# Altium schematic sheet KS_V3S.SchDoc
size A1
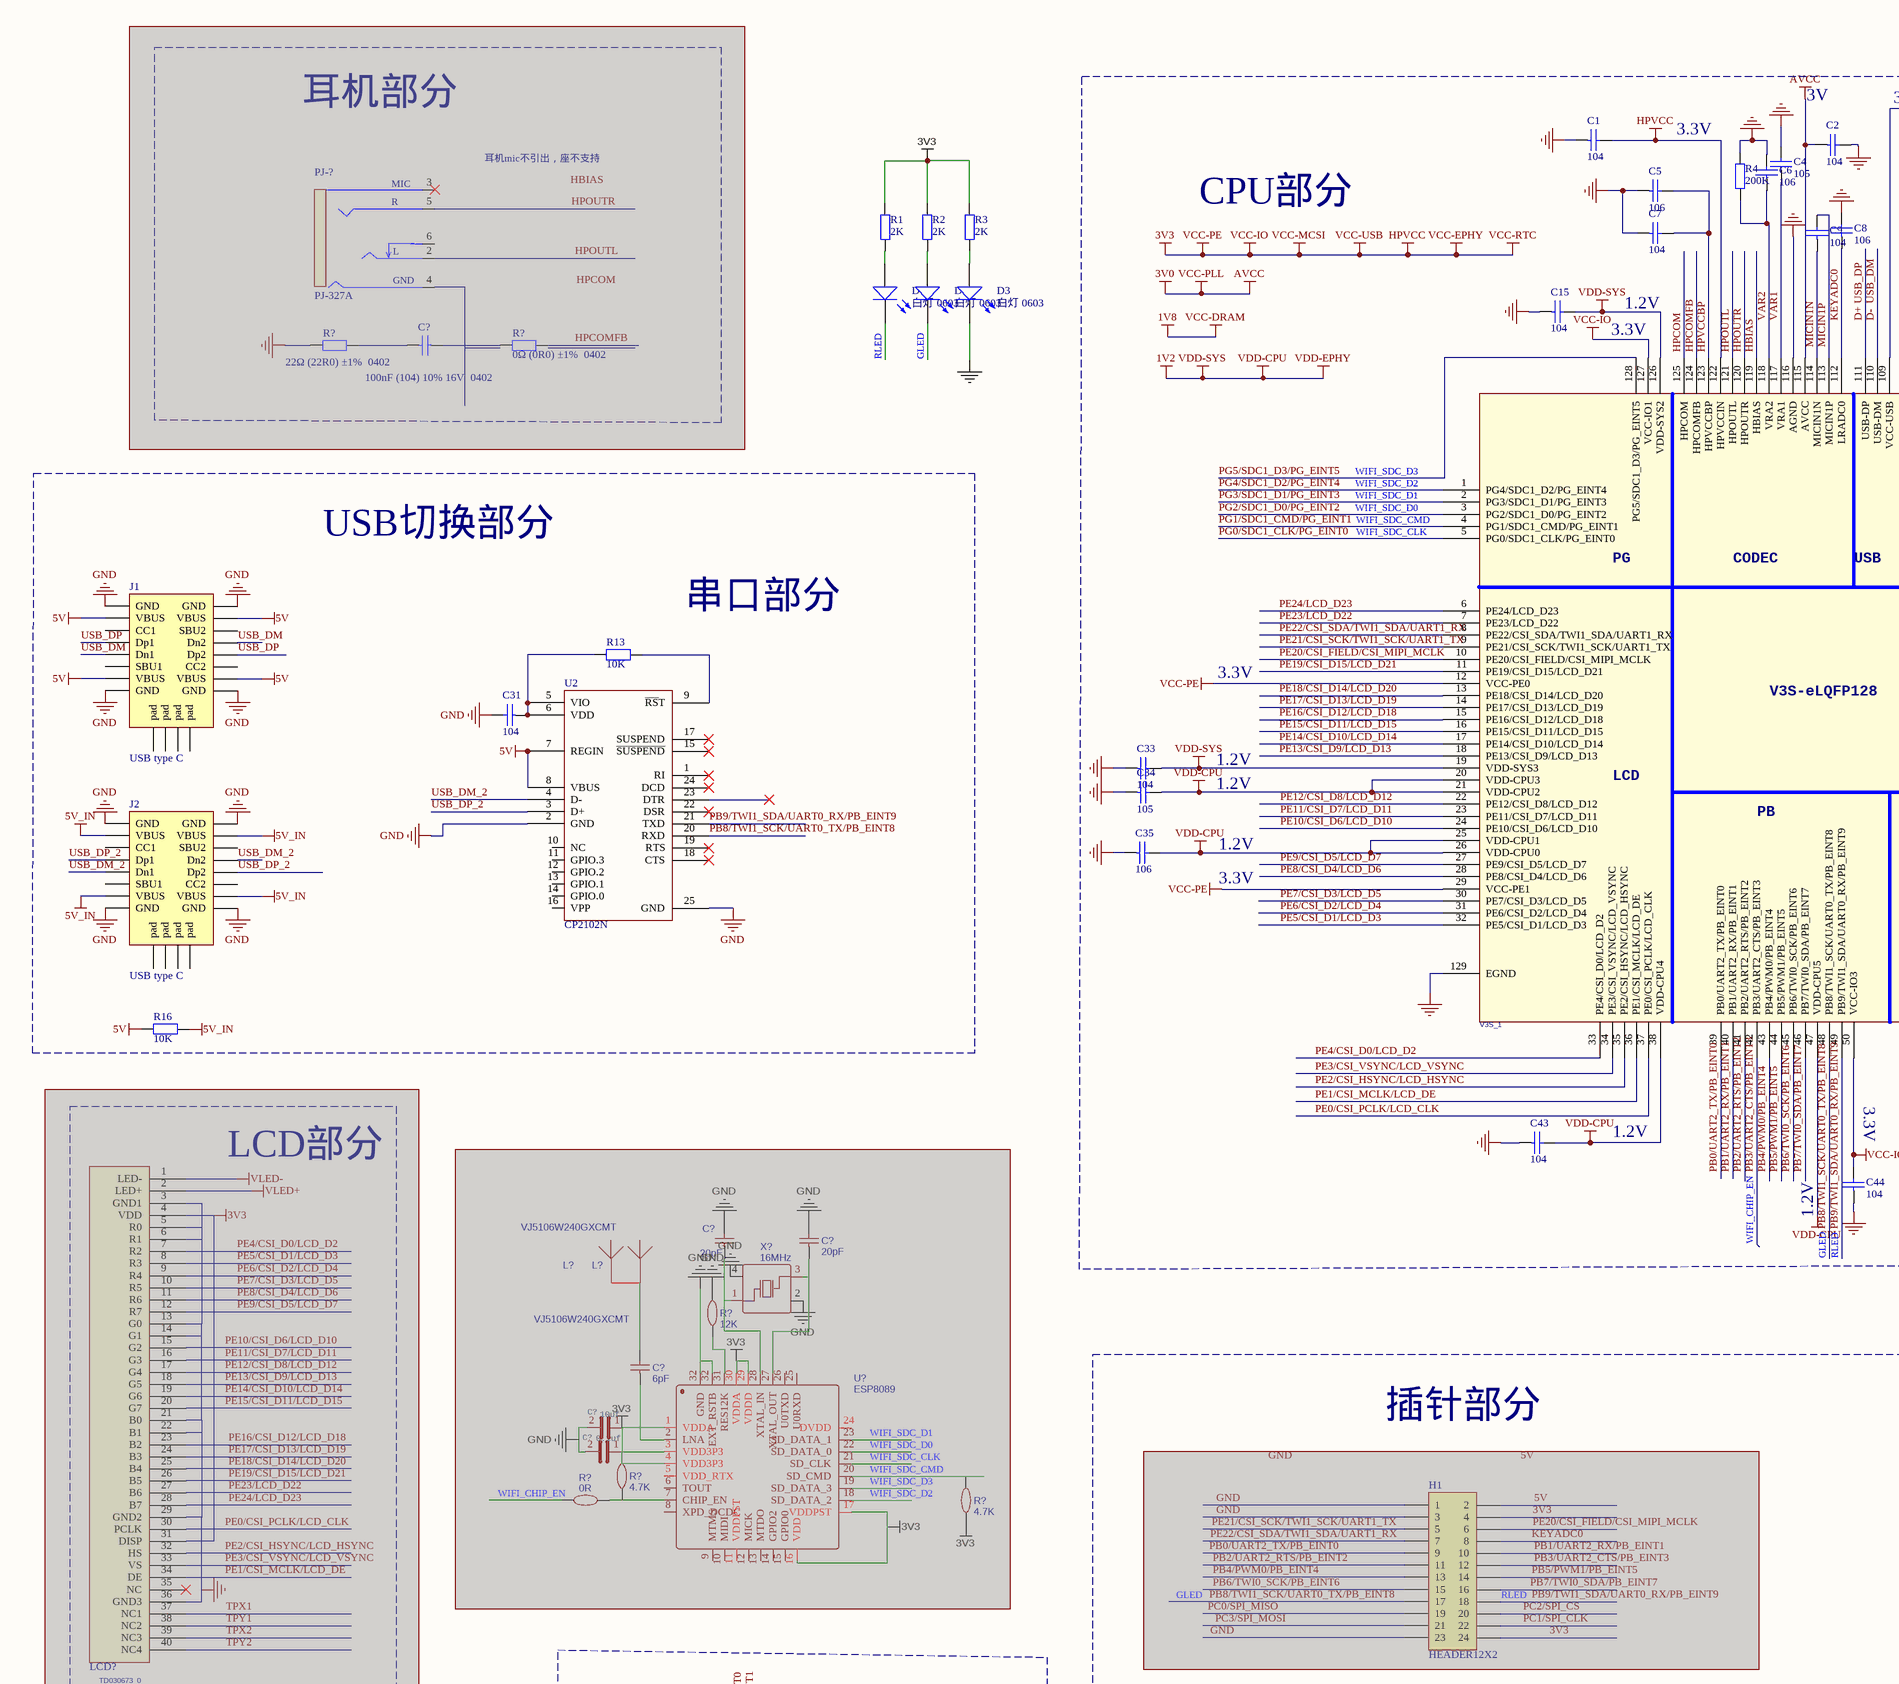
[diagram p0: KS_V3S.SchDoc, top left]
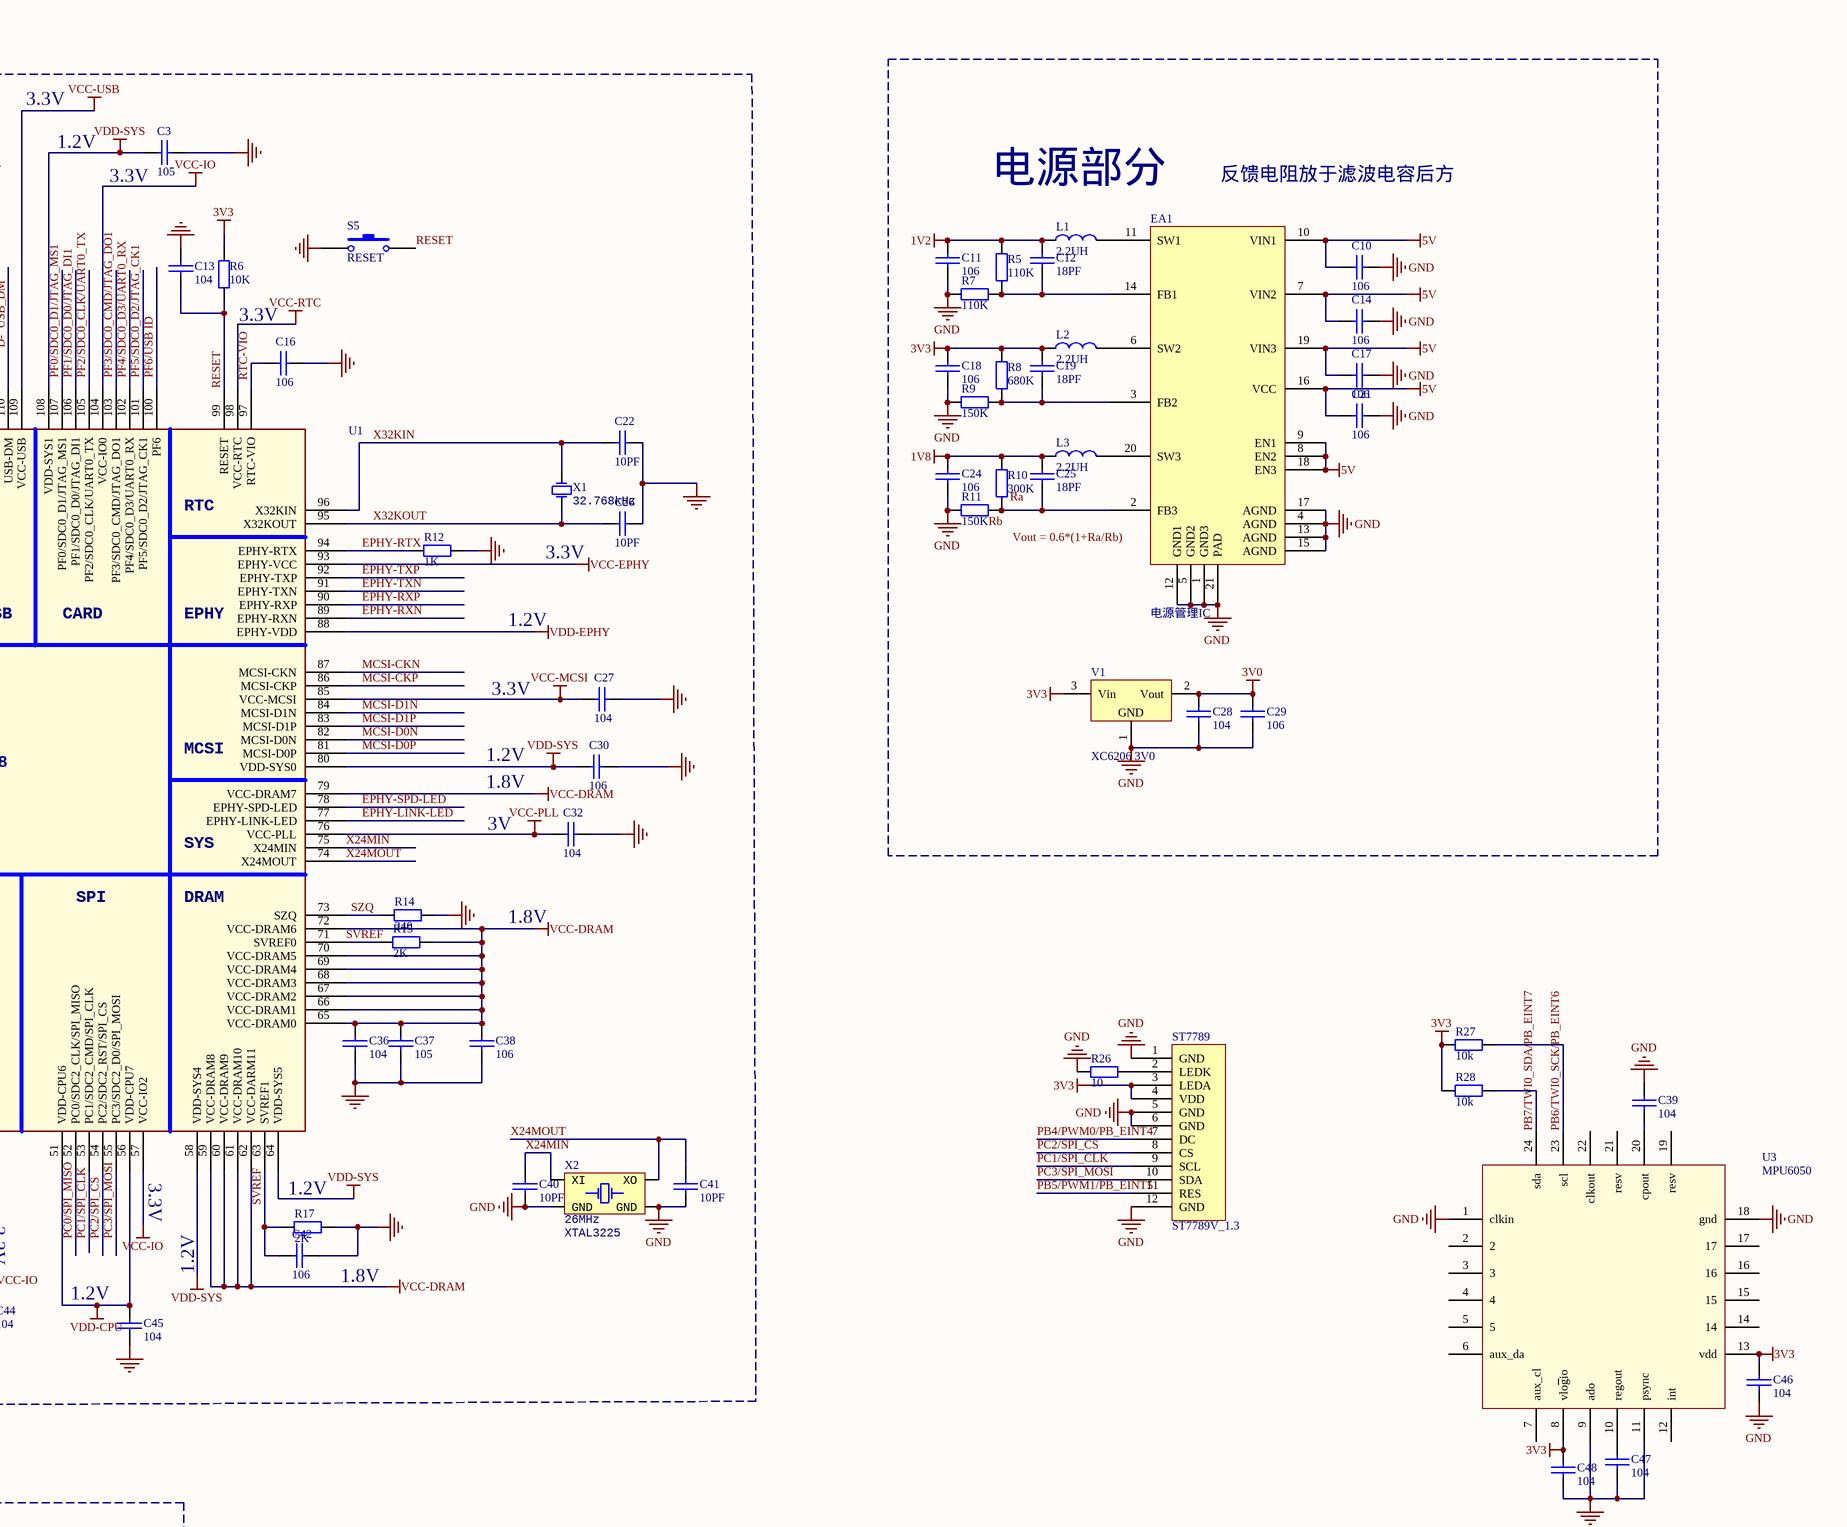
[diagram p1: KS_V3S.SchDoc, top right]
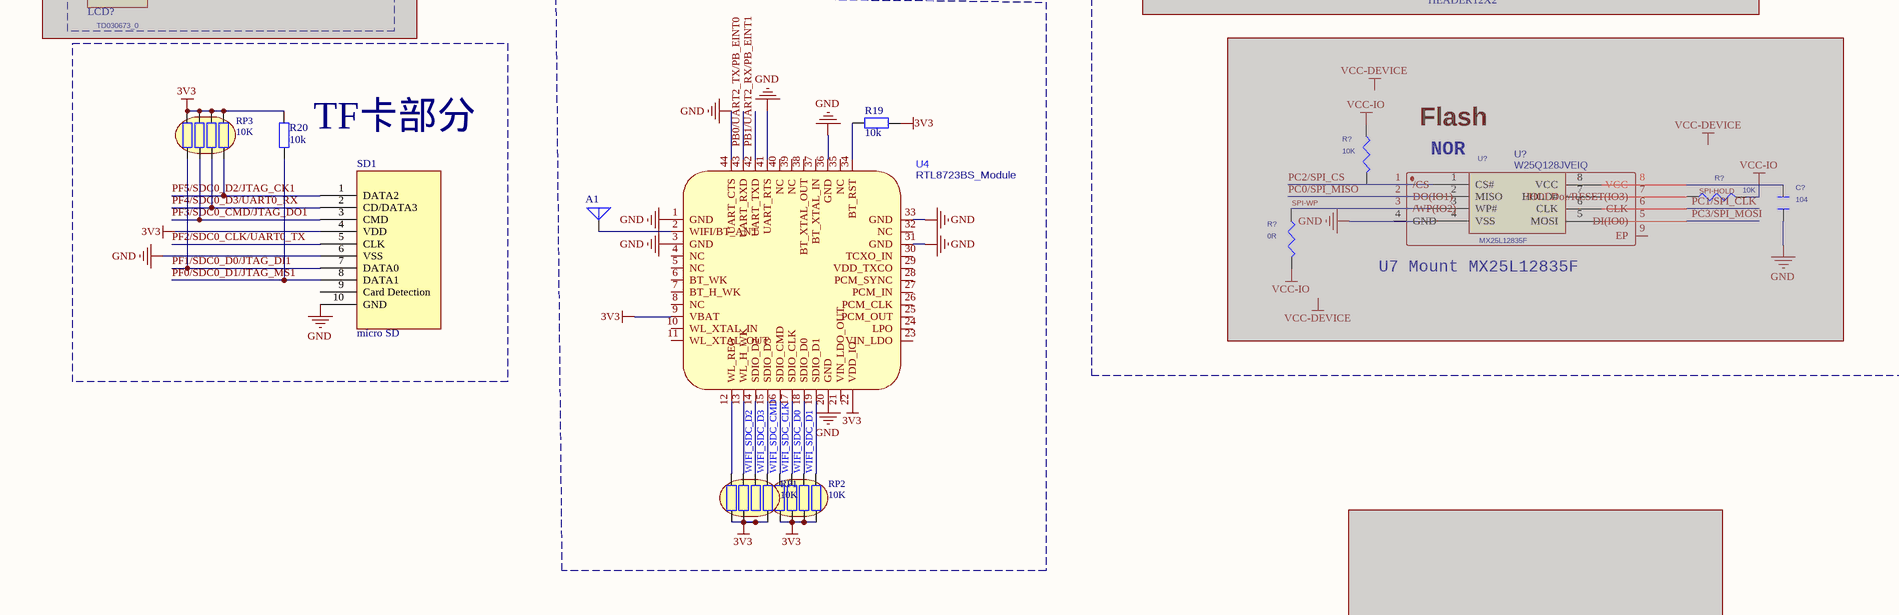
[diagram p2: KS_V3S.SchDoc, bottom left]
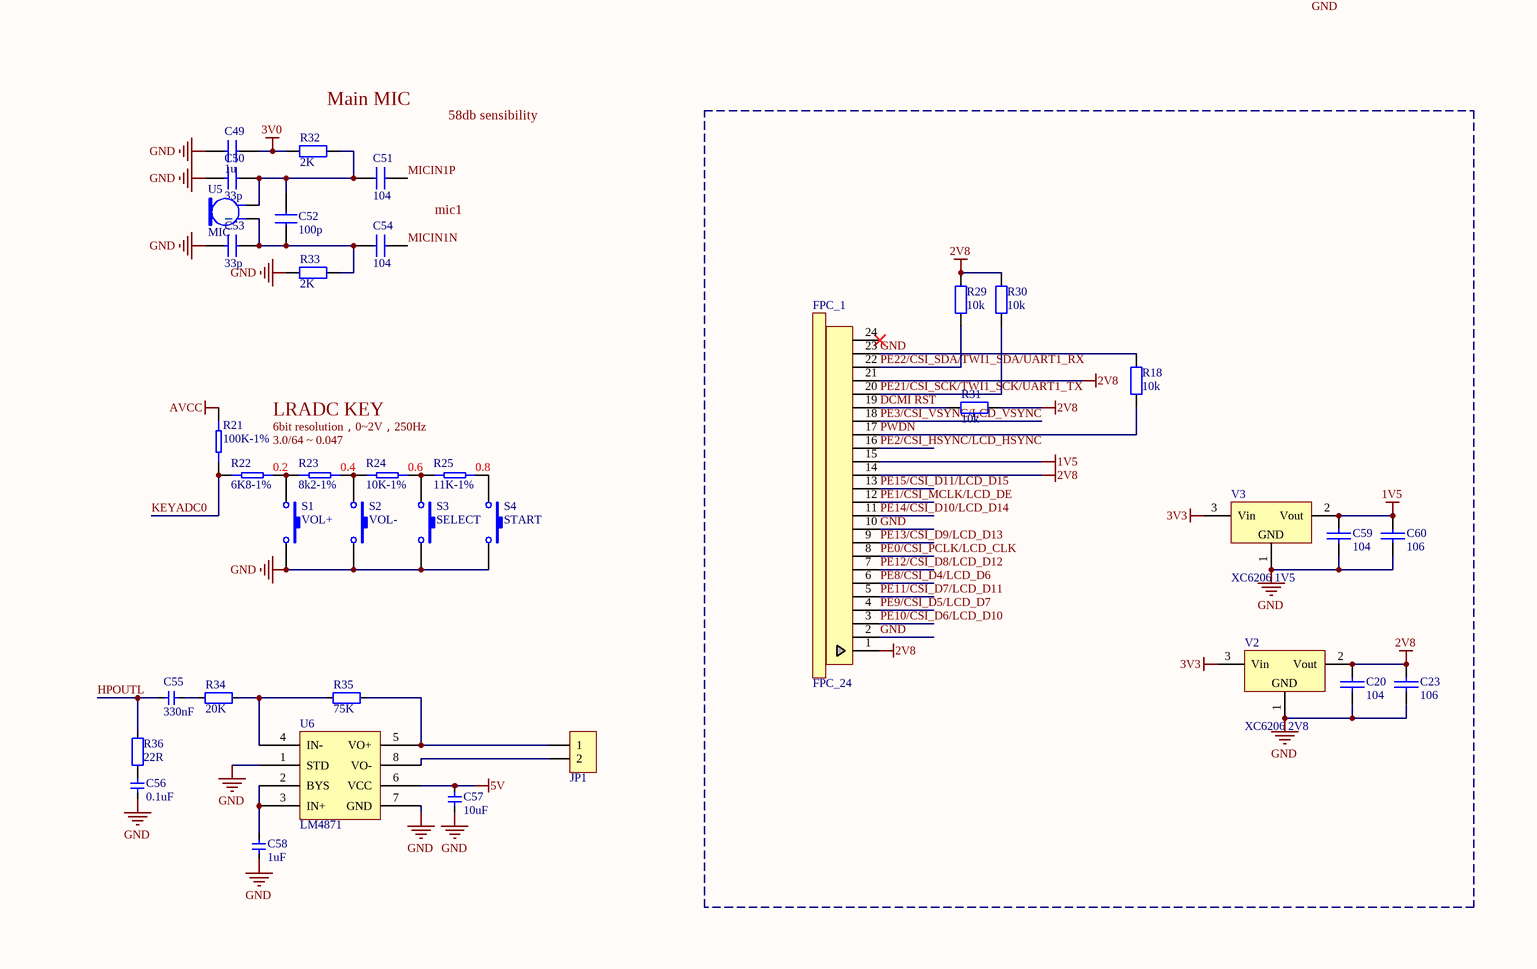
[diagram p3: KS_V3S.SchDoc, bottom right]

## Parts
(Parts that share a designator on the sheet are numbered #1, #2 ... from top to bottom, then left to right.)
A1  IPX_SMA  [IPX_SMA]  (value not drawn)
C1  104  [CAP_0402]
C2  104  [CAP_0402]
C3  105  [CAP_0402]
C4  105  [CAP_0402]
C5  106  [0603_C]
C6  106  [CAP_0402]
C7  104  [CAP_0402]
C8  106  [CAP_0402]
C9  104  [CAP_0402]
C10  106  [0805_C]
C11  106  [CAP_0402]
C12  18PF  [CAP_0402]
C13  104  [CAP_0402]
C14  106  [CAP_0402]
C15  104  [CAP_0402]
C16  106  [0805_C]
C17  106  [CAP_0402]
C18  106  [CAP_0402]
C19  18PF  [CAP_0402]
C20  104  [CAP_0402]
C21  106  [CAP_0402]
C22  10PF  [CAP_0402]
C23  106  [CAP_0402]
C24  106  [CAP_0402]
C25  18PF  [CAP_0402]
C26  10PF  [CAP_0402]
C27  104  [CAP_0402]
C28  104  [CAP_0402]
C29  106  [CAP_0402]
C30  106  [0603_C]
C31  104  [CAP_0402]
C32  104  [CAP_0402]
C33  104  [CAP_0402]
C34  105  [CAP_0402]
C35  106  [0603_C]
C36  104  [CAP_0402]
C37  105  [CAP_0402]
C38  106  [0603_C]
C39  104  [CAP_0402]
C40  10PF  [CAP_0402]
C41  10PF  [CAP_0402]
C42  106  [0603_C]
C43  104  [CAP_0402]
C44  104  [CAP_0402]
C45  104  [CAP_0402]
C46  104  [CAP_0402]
C47  104  [CAP_0402]
C48  104  [CAP_0402]
C49  1u  [CAP_0402]
C50  33p  [CAP_0402]
C51  104  [CAP_0402]
C52  100p  [CAP_0402]
C53  33p  [CAP_0402]
C54  104  [CAP_0402]
C55  330nF  [CAP_0402]
C56  0.1uF  [CAP_0402]
C57  10uF  [0805_C]
C58  1uF  [CAP_0402]
C59  104  [CAP_0402]
C60  106  [CAP_0402]
C?#1  100nF (104) 10% 16V  0402  [0402_R]  (masked out: inside a compile mask, not in the netlist)
C?#2  20pF  [0402]  (masked out: inside a compile mask, not in the netlist)
C?#3  20pF  [0402]  (masked out: inside a compile mask, not in the netlist)
C?#4  6pF  [0402]  (masked out: inside a compile mask, not in the netlist)
C?#5  10uf  [0603C]  (masked out: inside a compile mask, not in the netlist)
C?#6  0.1uf  [0402]  (masked out: inside a compile mask, not in the netlist)
C?#7  104  [C0402]  (masked out: inside a compile mask, not in the netlist)
D1  白灯 0603  [0603_LED_S1]
D2  白灯 0603  [0603_LED_S1]
D3  白灯 0603  [0603_LED_S1]
EA1  电源管理IC  [QFN20 3x3_M]
FPC_1  FPC_24  [FPC_24]
H1  HEADER12X2  [HEADER12X2]  (masked out: inside a compile mask, not in the netlist)
J1  USB type C  [USB Type-C-16Pin_A]
J2  USB type C  [USB Type-C-16Pin_A]
JP1  HDR-1X2  [MX 1.25-WI-2P]  (value not drawn)
L1  2.2UH  [2520-L]
L2  2.2UH  [2520-L]
L3  2.2UH  [2520-L]
L?#1  VJ5106W240GXCMT  [ANT-SMD_L3.1-W1.6]  (masked out: inside a compile mask, not in the netlist)
L?#2  VJ5106W240GXCMT  [ANT-SMD_2P-L11.4-W3.5]  (masked out: inside a compile mask, not in the netlist)
LCD?  TD030673_0  [FPC40pin]  (masked out: inside a compile mask, not in the netlist)
PJ-?  PJ-327A  [PJ-327A]  (masked out: inside a compile mask, not in the netlist)
R1  value 2K  [RES_0402]  (hidden comment: Res2)
R2  value 2K  [RES_0402]  (hidden comment: Res2)
R3  value 2K  [RES_0402]  (hidden comment: Res2)
R4  value 200K  [RES_0402]  (hidden comment: Res2)
R5  value 110K  [RES_0402]  (hidden comment: Res2)
R6  value 10K  [RES_0402]  (hidden comment: Res2)
R7  value 110K  [RES_0402]  (hidden comment: Res2)
R8  value 680K  [RES_0402]  (hidden comment: Res2)
R9  value 150K  [RES_0402]  (hidden comment: Res2)
R10  value 300K  [RES_0402]  (hidden comment: Res2)
R11  value 150K  [RES_0402]  (hidden comment: Res2)
R12  value 1K  [RES_0402]  (hidden comment: Res2)
R13  10K  [RES_0402]
R14  value 240  [RES_0402]  (hidden comment: Res2)
R15  value 2K  [RES_0402]  (hidden comment: Res2)
R16  value 10K  [LC-0805_R]  (hidden comment: 1A保险丝)
R17  value 2K  [RES_0402]  (hidden comment: Res2)
R18  value 10k  [RES_0402]  (hidden comment: Res2)
R19  value 10k  [RES_0402]  (hidden comment: Res2)
R20  value 10k  [RES_0402]  (hidden comment: Res2)
R21  100K-1%  [RES_0402]
R22  6K8-1%  [RES_0402]
R23  8k2-1%  [RES_0402]
R24  10K-1%  [RES_0402]
R25  11K-1%  [RES_0402]
R26  value 10  [RES_0402]  (hidden comment: Res2)
R27  value 10k  [RES_0402]  (hidden comment: Res2)
R28  value 10k  [RES_0402]  (hidden comment: Res2)
R29  value 10k  [RES_0402]  (hidden comment: Res2)
R30  value 10k  [RES_0402]  (hidden comment: Res2)
R31  value 10k  [RES_0402]  (hidden comment: Res2)
R32  value 2K  [RES_0402]  (hidden comment: Res2)
R33  value 2K  [RES_0402]  (hidden comment: Res2)
R34  20K  [RES_0402]
R35  75K  [RES_0402]
R36  22R  [RES_0402]
R?#1  22Ω (22R0) ±1%  0402  [0402_R]  (masked out: inside a compile mask, not in the netlist)
R?#2  0Ω (0R0) ±1%  0402  [0402_R]  (masked out: inside a compile mask, not in the netlist)
R?#3  12K  [0402]  (masked out: inside a compile mask, not in the netlist)
R?#4  4.7K  [0402]  (masked out: inside a compile mask, not in the netlist)
R?#5  0R  [0402]  (masked out: inside a compile mask, not in the netlist)
R?#6  4.7K  [0402]  (masked out: inside a compile mask, not in the netlist)
R?#7  10K  [0402]  (masked out: inside a compile mask, not in the netlist)
R?#8  10K  [0402]  (masked out: inside a compile mask, not in the netlist)
R?#9  0R  [0402]  (masked out: inside a compile mask, not in the netlist)
RP1  10K  [RCA-8P4R-0603]
RP2  10K  [RCA-8P4R-0603]
RP3  10K  [RCA-8P4R-0603]
S1  VOL+  [KEY_1]
S2  VOL-  [KEY_1]
S3  SELECT  [KEY_1]
S4  START  [KEY_1]
S5  RESET  [KEY_1]
SD1  micro SD  [TF卡座 短体 molex47309-2851_MOL]
ST7789  ST7789V_1.3  [ST7789V_12Pin]
U1  V3S_1  [LQFP129 14x14_N]
U2  CP2102N  [QFN24 4x4_N]
U3  MPU6050  [QFN24 4x4_M]
U4  RTL8723BS_Module  [R8723BS]
U5  MIC  [MIC-0416]
U6  LM4871  [MSOP-8]
U?#1  ESP8089  [QFN-32_L5.0-W5.0-P0.50-BL-EP3.7]  (masked out: inside a compile mask, not in the netlist)
U?#2  MX25L12835F  [SOIC-8_L5.3-W5.3-P1.27-LS8.0-BL]  (masked out: inside a compile mask, not in the netlist)
U?#3  W25Q128JVEIQ  [WSON-8_L6.0-W8.0-P1.27-BL-EP]  (masked out: inside a compile mask, not in the netlist)
V1  XC6206 3V0  [SOT23-3N]
V2  XC6206 2V8  [SOT23-3N]
V3  XC6206 1V5  [SOT23-3N]
X1  32.768kHz  [XT_3215_2]
X2  Type: XTAL3225  [XT_3225_4]  (hidden comment: 26MHz)
X?  16MHz  [OSC-SMD_4P-L3.2-W2.5-BL_SIT1602AI]  (masked out: inside a compile mask, not in the netlist)

## Blocks framed on the sheet
耳机部分: C?#1 PJ-? R?#1 R?#2
CPU部分: C1-C9 C13 C15 C16 C22 C26 C27 C30 C32-C38 C40-C45 R4 R6 R12 R14 R15 R17 S5 U1 X1 X2
电源部分: C10-C12 C14 C17-C19 C21 C24 C25 C28 C29 EA1 L1-L3 R5 R7-R11 V1
LCD部分: LCD?
插针部分: C?#7 H1 R?#7-R?#9 U?#2 U?#3
TF卡部分: R20 RP3 SD1

## Nets
1V2: C3.1 C11.2 C12.1 C15.2 C30.1 C33.2 C34.2 C35.2 C43.2 C45.2 L1.2 R5.2 U1.19(VDD-SYS3) U1.20(VDD-CPU3) U1.21(VDD-CPU2) U1.25(VDD-CPU1) U1.26(VDD-CPU0) U1.38(VDD-CPU4) U1.47(VDD-CPU5) U1.51(VDD-CPU6) U1.56(VDD-CPU7) U1.58(VDD-SYS4) U1.64(VDD-SYS5) U1.80(VDD-SYS0) U1.88(EPHY-VDD) U1.108(VDD-SYS1) U1.126(VDD-SYS2)  [also labelled VDD-CPU, VDD-EPHY, VDD-SYS]
1V5: C59.1 C60.1 FPC_1.15 V3.2(Vout)
1V8: C24.2 C25.1 C36.2 C37.2 C38.2 L3.2 R10.2 R15.1 U1.59(VCC-DRAM8) U1.60(VCC-DRAM9) U1.61(VCC-DRAM10) U1.62(VCC-DARM11) U1.65(VCC-DRAM0) U1.66(VCC-DRAM1) U1.67(VCC-DRAM2) U1.68(VCC-DRAM3) U1.69(VCC-DRAM4) U1.70(VCC-DRAM5) U1.72(VCC-DRAM6) U1.79(VCC-DRAM7)  [also labelled VCC-DRAM]
2V8: C20.1 C23.1 FPC_1.1 FPC_1.14 FPC_1.21 R29.2 R30.2 R31.1 V2.2(Vout)
3V0: C2.1 C28.1 C29.1 C32.1 C49.1 R21.1 R32.2 U1.76(VCC-PLL) U1.115(AVCC) V1.2(Vout)  [also labelled AVCC, VCC-PLL]
3V3: C1.2 C18.2 C19.1 C27.1 C44.2 C46.2 C48.2 L2.2 R1.1 R2.1 R3.1 R6.2 R8.2 R19.1 R20.1 R27.2 R28.2 RP1.5 RP1.6 RP1.7 RP1.8 RP2.5 RP2.6 RP2.7 RP2.8 RP3.1 RP3.2 RP3.3 RP3.4 SD1.4(VDD) ST7789.3(LEDA) ST7789.4(VDD) U1.12(VCC-PE0) U1.29(VCC-PE1) U1.50(VCC-IO3) U1.57(VCC-IO2) U1.85(VCC-MCSI) U1.93(EPHY-VCC) U1.98(VCC-RTC) U1.104(VCC-IO0) U1.109(VCC-USB) U1.122(HPVCCIN) U1.127(VCC-IO1) U3.8(vlo~{g}io) U3.13(vdd) U4.9(VBAT) U4.22(VDD_IO) V1.3(Vin) V2.3(Vin) V3.3(Vin)  [also labelled HPVCC, VCC-EPHY, VCC-IO, VCC-MCSI, VCC-PE, VCC-RTC, VCC-USB]
5V: C10.1 C14.1 C17.1 C21.1 C57.2 EA1.7(VIN2) EA1.8(EN2) EA1.9(EN1) EA1.10(VIN1) EA1.16(VCC) EA1.18(EN3) EA1.19(VIN3) J1.A4(VBUS) J1.A9(VBUS) J1.B4(VBUS) J1.B9(VBUS) R16.1 U2.7(REGIN) U2.8(VBUS) U6.6(VCC)
5V_IN: J2.A4(VBUS) J2.A9(VBUS) J2.B4(VBUS) J2.B9(VBUS) R16.2
GND: C1.1 C2.2 C3.2 C4.2 C5.1 C6.2 C7.1 C8.2 C10.2 C11.1 C13.2 C14.2 C15.1 C16.2 C17.2 C18.1 C20.2 C21.2 C22.2 C23.2 C24.1 C26.2 C27.2 C28.2 C29.2 C30.2 C31.2 C32.2 C33.1 C34.1 C35.1 C36.1 C37.1 C38.1 C39.2 C40.2 C41.2 C42.2 C43.1 C44.1 C45.1 C46.1 C47.1 C48.1 C49.2 C50.1 C53.1 C56.1 C57.1 C58.1 C59.2 C60.2 D3.K EA1.1(GND3) EA1.4(AGND) EA1.5(GND2) EA1.12(GND1) EA1.13(AGND) EA1.15(AGND) EA1.17(AGND) EA1.21(PAD) FPC_1.2 FPC_1.10 FPC_1.23 J1.A1(GND) J1.A12(GND) J1.B1(GND) J1.B12(GND) J2.A1(GND) J2.A12(GND) J2.B1(GND) J2.B12(GND) R4.2 R7.1 R9.1 R11.1 R12.1 R14.1 R17.1 R18.2 R26.2 R33.2 S1.1 S2.1 S3.1 S4.1 S5.2 SD1.6(VSS) SD1.10(GND) ST7789.1(GND) ST7789.5(GND) ST7789.6(GND) ST7789.12(GND) U1.116(AGND) U1.129(EGND) U2.2(GND) U2.25(GND) U3.1(clkin) U3.9(ado) U3.11(psync) U3.18(gnd) U4.1(GND) U4.3(GND) U4.20(GND) U4.31(GND) U4.33(GND) U4.36(GND) U4.41(UART_RTS) U4.44(UART_CTS) U6.1(STD) U6.7(GND) V1.1(GND) V2.1(GND) V3.1(GND) X2.2(GND) X2.4(GND)
D+: J1.A6(Dp1) J1.B6(Dp2) U1.111(USB-DP)  [also labelled USB_DP]
D-: J1.A7(Dn1) J1.B7(Dn2) U1.110(USB-DM)  [also labelled USB_DM]
DCMI RST: FPC_1.19 R31.2
EPHY-LINK-LED: U1.77(EPHY-LINK-LED)
EPHY-RTX: R12.2 U1.94(EPHY-RTX)
EPHY-RXN: U1.89(EPHY-RXN)
EPHY-RXP: U1.90(EPHY-RXP)
EPHY-SPD-LED: U1.78(EPHY-SPD-LED)
EPHY-TXN: U1.91(EPHY-TXN)
EPHY-TXP: U1.92(EPHY-TXP)
GLED: D2.K U1.48(PB8/TWI1_SCK/UART0_TX/PB_EINT8) U2.20(RXD)  [also labelled PB8/TWI1_SCK/UART0_TX/PB_EINT8]
HBIAS: U1.119(HBIAS)
HPCOM: U1.125(HPCOM)
HPCOMFB: U1.124(HPCOMFB)
HPOUTL: C55.2 R36.2 U1.121(HPOUTL)
HPOUTR: U1.120(HPOUTR)
HPVCCBP: C5.2 C7.2 U1.123(HPVCCBP)
KEYADC0: C8.1 R21.2 R22.2 U1.112(LRADC0)
MCSI-CKN: U1.87(MCSI-CKN)
MCSI-CKP: U1.86(MCSI-CKP)
MCSI-D0N: U1.82(MCSI-D0N)
MCSI-D0P: U1.81(MCSI-D0P)
MCSI-D1N: U1.84(MCSI-D1N)
MCSI-D1P: U1.83(MCSI-D1P)
MICIN1N: C9.1 C54.2 U1.114(MICIN1N)
MICIN1P: C9.2 C51.2 U1.113(MICIN1P)
PB0/UART2_TX/PB_EINT0: U1.39(PB0/UART2_TX/PB_EINT0) U4.43(UART_RXD)
PB1/UART2_RX/PB_EINT1: U1.40(PB1/UART2_RX/PB_EINT1) U4.42(UART_TXD)
PB2/UART2_RTS/PB_EINT2: U1.41(PB2/UART2_RTS/PB_EINT2)
PB3/UART2_CTS/PB_EINT3: U1.42(PB3/UART2_CTS/PB_EINT3)  [also labelled WIFI_CHIP_EN]
PB4/PWM0/PB_EINT4: ST7789.7(DC) U1.43(PB4/PWM0/PB_EINT4)
PB5/PWM1/PB_EINT5: ST7789.11(RES) U1.44(PB5/PWM1/PB_EINT5)
PB6/TWI0_SCK/PB_EINT6: R27.1 U1.45(PB6/TWI0_SCK/PB_EINT6) U3.23(scl)
PB7/TWI0_SDA/PB_EINT7: R28.1 U1.46(PB7/TWI0_SDA/PB_EINT7) U3.24(sda)
PB9/TWI1_SDA/UART0_RX/PB_EINT9: D1.K U1.49(PB9/TWI1_SDA/UART0_RX/PB_EINT9) U2.21(TXD)  [also labelled RLED]
PC0/SPI_MISO: U1.52(PC0/SDC2_CLK/SPI_MISO)
PC1/SPI_CLK: ST7789.9(SCL) U1.53(PC1/SDC2_CMD/SPI_CLK)
PC2/SPI_CS: ST7789.8(CS) U1.54(PC2/SDC2_RST/SPI_CS)
PC3/SPI_MOSI: ST7789.10(SDA) U1.55(PC3/SDC2_D0/SPI_MOSI)
PE0/CSI_PCLK/LCD_CLK: FPC_1.8 U1.37(PE0/CSI_PCLK/LCD_CLK)
PE1/CSI_MCLK/LCD_DE: FPC_1.12 U1.36(PE1/CSI_MCLK/LCD_DE)
PE2/CSI_HSYNC/LCD_HSYNC: FPC_1.16 U1.35(PE2/CSI_HSYNC/LCD_HSYNC)
PE3/CSI_VSYNC/LCD_VSYNC: FPC_1.18 U1.34(PE3/CSI_VSYNC/LCD_VSYNC)
PE4/CSI_D0/LCD_D2: U1.33(PE4/CSI_D0/LCD_D2)
PE5/CSI_D1/LCD_D3: U1.32(PE5/CSI_D1/LCD_D3)
PE6/CSI_D2/LCD_D4: U1.31(PE6/CSI_D2/LCD_D4)
PE7/CSI_D3/LCD_D5: U1.30(PE7/CSI_D3/LCD_D5)
PE8/CSI_D4/LCD_D6: FPC_1.6 U1.28(PE8/CSI_D4/LCD_D6)
PE9/CSI_D5/LCD_D7: FPC_1.4 U1.27(PE9/CSI_D5/LCD_D7)
PE10/CSI_D6/LCD_D10: FPC_1.3 U1.24(PE10/CSI_D6/LCD_D10)
PE11/CSI_D7/LCD_D11: FPC_1.5 U1.23(PE11/CSI_D7/LCD_D11)
PE12/CSI_D8/LCD_D12: FPC_1.7 U1.22(PE12/CSI_D8/LCD_D12)
PE13/CSI_D9/LCD_D13: FPC_1.9 U1.18(PE13/CSI_D9/LCD_D13)
PE14/CSI_D10/LCD_D14: FPC_1.11 U1.17(PE14/CSI_D10/LCD_D14)
PE15/CSI_D11/LCD_D15: FPC_1.13 U1.16(PE15/CSI_D11/LCD_D15)
PE16/CSI_D12/LCD_D18: U1.15(PE16/CSI_D12/LCD_D18)
PE17/CSI_D13/LCD_D19: U1.14(PE17/CSI_D13/LCD_D19)
PE18/CSI_D14/LCD_D20: U1.13(PE18/CSI_D14/LCD_D20)
PE19/CSI_D15/LCD_D21: U1.11(PE19/CSI_D15/LCD_D21)
PE20/CSI_FIELD/CSI_MIPI_MCLK: U1.10(PE20/CSI_FIELD/CSI_MIPI_MCLK)
PE21/CSI_SCK/TWI1_SCK/UART1_TX: FPC_1.20 R30.1 U1.9(PE21/CSI_SCK/TWI1_SCK/UART1_TX)
PE22/CSI_SDA/TWI1_SDA/UART1_RX: FPC_1.22 R29.1 U1.8(PE22/CSI_SDA/TWI1_SDA/UART1_RX)
PE23/LCD_D22: U1.7(PE23/LCD_D22)
PE24/LCD_D23: U1.6(PE24/LCD_D23)
PF0/SDC0_D1/JTAG_MS1: R20.2 SD1.8(DATA1) U1.107(PF0/SDC0_D1/JTAG_MS1)
PF1/SDC0_D0/JTAG_DI1: RP3.5 SD1.7(DATA0) U1.106(PF1/SDC0_D0/JTAG_DI1)
PF2/SDC0_CLK/UART0_TX: SD1.5(CLK) U1.105(PF2/SDC0_CLK/UART0_TX)
PF3/SDC0_CMD/JTAG_DO1: RP3.6 SD1.3(CMD) U1.103(PF3/SDC0_CMD/JTAG_DO1)
PF4/SDC0_D3/UART0_RX: RP3.7 SD1.2(CD/DATA3) U1.102(PF4/SDC0_D3/UART0_RX)
PF5/SDC0_D2/JTAG_CK1: RP3.8 SD1.1(DATA2) U1.101(PF5/SDC0_D2/JTAG_CK1)
PF6/USB ID: U1.100(PF6)
PG0/SDC1_CLK/PG_EINT0: RP2.3 U1.5(PG0/SDC1_CLK/PG_EINT0) U4.17(SDIO_CLK)  [also labelled WIFI_SDC_CLK]
PG1/SDC1_CMD/PG_EINT1: RP2.4 U1.4(PG1/SDC1_CMD/PG_EINT1) U4.16(SDIO_CMD)  [also labelled WIFI_SDC_CMD]
PG2/SDC1_D0/PG_EINT2: RP2.2 U1.3(PG2/SDC1_D0/PG_EINT2) U4.18(SDIO_D0)  [also labelled WIFI_SDC_D0]
PG3/SDC1_D1/PG_EINT3: RP2.1 U1.2(PG3/SDC1_D1/PG_EINT3) U4.19(SDIO_D1)  [also labelled WIFI_SDC_D1]
PG4/SDC1_D2/PG_EINT4: RP1.2 U1.1(PG4/SDC1_D2/PG_EINT4) U4.14(SDIO_D2)  [also labelled WIFI_SDC_D2]
PG5/SDC1_D3/PG_EINT5: RP1.1 U1.128(PG5/SDC1_D3/PG_EINT5) U4.15(SDIO_D3)  [also labelled WIFI_SDC_D3]
PWDN: FPC_1.17 R18.1
RESET: C13.1 R6.1 S5.1 U1.99(RESET)
RTC-VIO: C16.1 U1.97(RTC-VIO)
SVREF: C42.1 R15.2 R17.2 U1.63(SVREF1) U1.71(SVREF0)
SZQ: R14.2 U1.73(SZQ)
USB_DM_2: J2.A7(Dn1) J2.B7(Dn2) U2.4(D-)
USB_DP_2: J2.A6(Dp1) J2.B6(Dp2) U2.3(D+)
VAR1: C4.1 U1.117(VRA1)
VAR2: C6.1 R4.1 U1.118(VRA2)
X24MIN: C40.1 U1.75(X24MIN) X2.1(XI)
X24MOUT: C41.1 U1.74(X24MOUT) X2.3(XO)
X32KIN: C22.1 U1.96(X32KIN) X1.2(OSC2)
X32KOUT: C26.1 U1.95(X32KOUT) X1.1(OSC1)
NetA1_1: A1.1(S) U4.2(WIFI/BT_ANT)
NetC12_2: C12.2 EA1.14(FB1) R5.1 R7.2
NetC19_2: C19.2 EA1.3(FB2) R8.1 R9.2
NetC25_2: C25.2 EA1.2(FB3) R10.1 R11.2
NetC31_1: C31.1 R13.2 U2.5(VIO) U2.6(VDD)
NetC39_1: C39.1 U3.20(cpout)
NetC47_2: C47.2 U3.10(regout)
NetC50_2: C50.2 C51.1 C52.1 R32.1 U5.2
NetC52_2: C52.2 C53.2 C54.1 R33.1 U5.1
NetC55_1: C55.1 R34.1
NetC56_2: C56.2 R36.1
NetC58_2: C58.2 U6.2(BYS) U6.3(IN+)
NetD1_A: D1.A R1.2
NetD2_A: D2.A R2.2
NetD3_A: D3.A R3.2
NetEA1_6: EA1.6(SW2) L2.1
NetEA1_11: EA1.11(SW1) L1.1
NetEA1_20: EA1.20(SW3) L3.1
NetJP1_1: JP1.1 R35.2 U6.5(VO+)
NetJP1_2: JP1.2 U6.8(VO-)
NetR13_1: R13.1 U2.9(~{RS}T)
NetR19_2: R19.2 U4.34(BT_RST)
NetR22_1: R22.1 R23.2 S1.2
NetR23_1: R23.1 R24.2 S2.2
NetR24_1: R24.1 R25.2 S3.2
NetR25_1: R25.1 S4.2
NetR26_1: R26.1 ST7789.2(LEDK)
NetR34_2: R34.2 R35.1 U6.4(IN-)
NetRP1_3: RP1.3 U4.13(WL_H_WK)
NetRP1_4: RP1.4 U4.12(WL_REG)

Not connected (* = marked no-connect by the designer): FPC_1 24*; J1 0(pad) A5(CC1) A8(SBU1) B5(CC2) B8(SBU2); J2 0(pad) A5(CC1) A8(SBU1) B5(CC2) B8(SBU2); SD1 9(Card_Detection); U2 1(RI)* 10(NC) 11(GPIO.3) 12(GPIO.2) 13(GPIO.1) 14(GPIO.0) 15(~{SUSPEND})* 16(VPP) 17(SUSPEND)* 18(CTS)* 19(RTS)* 22(DSR)* 23(DTR)* 24(DCD)*; U3 2 3 4 5 6(aux_da) 7(aux_cl) 12(int) 14 15 16 17 19(resv) 21(resv) 22(clkout); U4 4(NC) 5(NC) 6(BT_WK) 7(BT_H_WK) 8(NC) 10(WL_XTAL_IN) 11(WL_XTAL_OUT) 21(VIN_LDO_OUT) 23(VIN_LDO) 24(LPO) 25(PCM_OUT) 26(PCM_CLK) 27(PCM_IN) 28(PCM_SYNC) 29(VDD_TXCO) 30(TCXO_IN) 32(NC) 35(NC) 37(BT_XTAL_IN) 38(BT_XTAL_OUT) 39(NC) 40(NC)

## Notes on the sheet
- 耳机mic不引出，座不支持
- 3.3V
- 3V
- 1.2V
- (near C3) 3.3V
- 反馈电阻放于滤波电容后方
- USB切换部分
- 串口部分
- 1.8V
- (near U1) 3.3V
- (near C44) 3.3V
- (near R17) 1.2V
- (near C45) 1.2V
- (near C44) 1.2V
- Main MIC
- (near R32) 58db sensibility
- mic1
- Flash
- 6bit resolution，0~2V，250Hz
- LRADC KEY
- 3.0/64 ~ 0.047
- (near U?#3) NOR
- (near R22) 0.2
- (near R23) 0.4
- (near R24) 0.6
- (near R25) 0.8
- (near U?#3) U7 Mount MX25L12835F
- Labels drawn without touching a wire or pin: Ra, Rb, Vout = 0.6*(1+Ra/Rb)
- (in symbol V3S_1) RTC; PG; CODEC; USB; CARD; EPHY; MCSI; V3S-eLQFP128; SYS; LCD; PB; SPI; DRAM

## Library data of the parts
A1 = IPX_SMA: IPX
C1-C48 C59 C60 = CAP
C49-C54 = CAP: SMD-CAP
C55 = 电容-0603: Capacitor; Value: 0.1u
C56-C58 = 电容-0402: Capacitor; Value: 0.1u
C?#1 = 0402 100nF (104) 10% 16V: 贴片电容; ComponentLink1Description: 供应商链接; ComponentLink1URL: http://www.szlcsc.com/product/details_1877.html; Package: 0402; Supplier: LC; SuppliersPartNumber: C1525
C?#2 C?#3 = 20pF: BOM_Manufacturer Part: CL05C200JB5NNNC; BOM_Manufacturer: SAMSUNG; nameAlias: Capacitance; SMT Type: Extend; BOM_Supplier: LCSC; BOM_Supplier Part: C32950; BOM_LCSC Assembly: Yes; spicePre: C; spiceSymbolName: CL05C200JB5NNNC
C?#4 = 6pF: BOM_Manufacturer: FH; BOM_Manufacturer Part: 0402CG0R5C500NT; nameAlias: Capacitance; BOM_Supplier: LCSC; BOM_Supplier Part: C1544; spicePre: C; spiceSymbolName: 0402CG0R5C500NT
C?#7 = CAPACITOR_Dup1: PAGE: 7
D1-D3 = 0603 白灯: 发光二极管; ComponentLink1Description: 供应商链接; ComponentLink1URL: http://www.szlcsc.com/product/details_2663.html; Package: 0603; Supplier: LC; SuppliersPartNumber: C2290
EA1 = EA3036
J1 J2 = USB_C
JP1 = Header 2: 2P接插件; 版权归属: 源创客; BOM名称: 2P接插件; 学习资源: www.ooocke.com
L1-L3 = L1: 电感
L?#1 L?#2 = VJ5106W240GXCMT: BOM_Manufacturer: VISHAY; nameAlias: Value; BOM_Supplier: LCSC; BOM_Manufacturer Part: VJ5106W240GXCMT; BOM_Supplier Part: C154434; spicePre: L; spiceSymbolName: VJ5106W240GXCMT
R1-R12 R14-R20 R26-R33 = Res2: Resistor; Published: 8-Jun-2000; LatestRevisionDate: 17-Jul-2002; LatestRevisionNote: Re-released for DXP Platform.; PackageReference: AXIAL-0.4; Publisher: Altium Limited
R13 = RES: 普通电阻
R21-R25 = R
R34 R35 = 电阻-0402: Resistor; Value: 22R
R36 = 电阻-0402: Resistor; Value: 22R
R?#1 = 0402 22Ω (22R0) 1%: 贴片电阻; ComponentLink1Description: 供应商链接; ComponentLink1URL: http://www.szlcsc.com/product/details_25835.html; Package: 0402; Supplier: LC; SuppliersPartNumber: C25092
R?#2 = 0402 0Ω (0R0) 1%: 贴片电阻; ComponentLink1Description: 供应商链接; ComponentLink1URL: http://www.szlcsc.com/product/details_17853.html; Package: 0402; Supplier: LC; SuppliersPartNumber: C17168
R?#3 = 12K: BOM_Manufacturer: RALEC; BOM_Manufacturer Part: RTT021202FTH; nameAlias: Resistance (Ohms); BOM_Supplier: LCSC; BOM_Supplier Part: C102781; spicePre: R; spiceSymbolName: RTT021202FTH
R?#4 R?#6 = 4.7K: BOM_Manufacturer: RALEC; BOM_Manufacturer Part: RTT021202FTH; nameAlias: Resistance (Ohms); BOM_Supplier: LCSC; BOM_Supplier Part: C102781; spicePre: R; spiceSymbolName: RTT021202FTH
R?#5 = 0R: BOM_Manufacturer: RALEC; BOM_Manufacturer Part: RTT021202FTH; nameAlias: Resistance (Ohms); BOM_Supplier: LCSC; BOM_Supplier Part: C102781; spicePre: R; spiceSymbolName: RTT021202FTH
R?#7-R?#9 = RESISTOR_Dup1: PAGE: 7
RP1-RP3 = 224: BOM名称: 贴片网络排阻; 版权归属: 源创客; 学习资源: www.ooocke.com
S1-S5 = SW-PB: Switch; Published: 24-Mar-1999; LatestRevisionDate: 17-Jul-2002; LatestRevisionNote: Re-released for DXP Platform.; PackageReference: SPST-2; Publisher: Altium Limited
U2 = CP2104
U?#1 = ESP8089: BOM_Manufacturer: ESPRESSIF; nameAlias: Frequency; SMT Type: Extend; BOM_Supplier: LCSC; BOM_Manufacturer Part: ESP8089; image: //image.lceda.cn/szlcsc/C80815.jpg; BOM_Supplier Part: C80815; BOM_LCSC Assembly: Yes; spicePre: U; spiceSymbolName: ESP8089
U?#2 = SPI-NOR-SO8: PAGE: 7
U?#3 = W25Q128JVEIQ: BOM_Manufacturer: Winbond Elec; Contributor: LCSC; BOM_Supplier: LCSC; BOM_Supplier Part: C401662; BOM_Manufacturer Part: W25Q128JVEIQ; spicePre: U; spiceSymbolName: W25Q128JVEIQ
V1-V3 = XC6206P332MR: 低压差线性稳压芯片; 版权归属: 源创客; BOM名称: 低压差线性稳压芯片; 学习资源: www.ooocke.com
X1 = XTAL_32.768k: Crystal Oscillator; Value: 32.768kHz
X2 = XTAL_3225_4P: Crystal Oscillator; Value: 26MHz
X? = 16MHz: BOM_Manufacturer: TAE; BOM_Manufacturer Part: SMD-3225_4P16M9pf10ppm; nameAlias: Frequency; Contributor: LCSC; SMT Type: Extend; BOM_Supplier: LCSC; BOM_Supplier Part: C133335; BOM_LCSC Assembly: Yes; spicePre: X; spiceSymbolName: SMD-3225_4P16M9PF10PPM